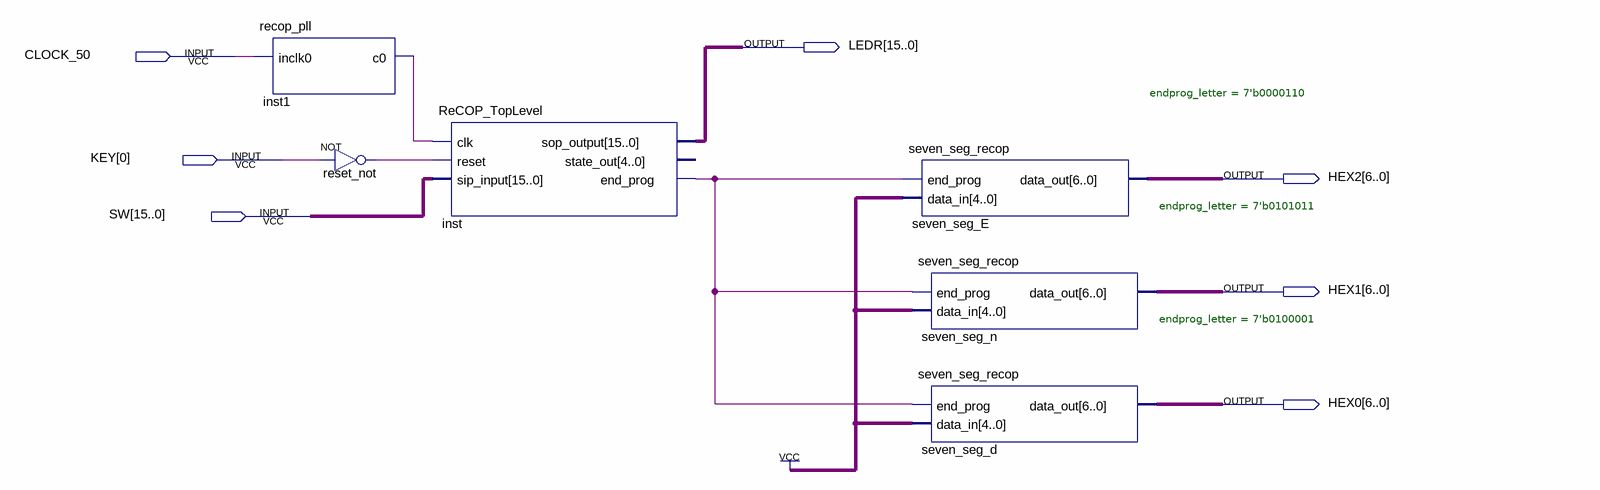
[diagram p0: schematic sheet]
// Quartus schematic ReCOP_bd.bdf as structural Verilog: 6 symbols, 7 pins
module ReCOP_bd (
  input  CLOCK_50,
  input  [0:0] KEY,
  input  [15:0] SW,
  output [15:0] LEDR,
  output [6:0] HEX2,
  output [6:0] HEX1,
  output [6:0] HEX0
);

  wire inst1_c0, inst_end_prog, reset_not_out;

  recop_pll inst1 (.inclk0(CLOCK_50), .c0(inst1_c0));
  not reset_not (reset_not_out, KEY[0]);
  ReCOP_TopLevel inst (
    .clk(inst1_c0), .reset(reset_not_out), .sip_input(SW), .sop_output(LEDR), .end_prog(inst_end_prog));  // open: state_out
  seven_seg_recop #(.endprog_letter(7'b0000110)) seven_seg_E (
    .end_prog(inst_end_prog), .data_in({5{1'b1}}), .data_out(HEX2));
  seven_seg_recop #(.endprog_letter(7'b0101011)) seven_seg_n (
    .end_prog(inst_end_prog), .data_in({5{1'b1}}), .data_out(HEX1));
  seven_seg_recop #(.endprog_letter(7'b0100001)) seven_seg_d (
    .end_prog(inst_end_prog), .data_in({5{1'b1}}), .data_out(HEX0));
endmodule
